# EAGLE design Shruthi-Analog-LP2Delay-v01 (EAGLE 5.09)
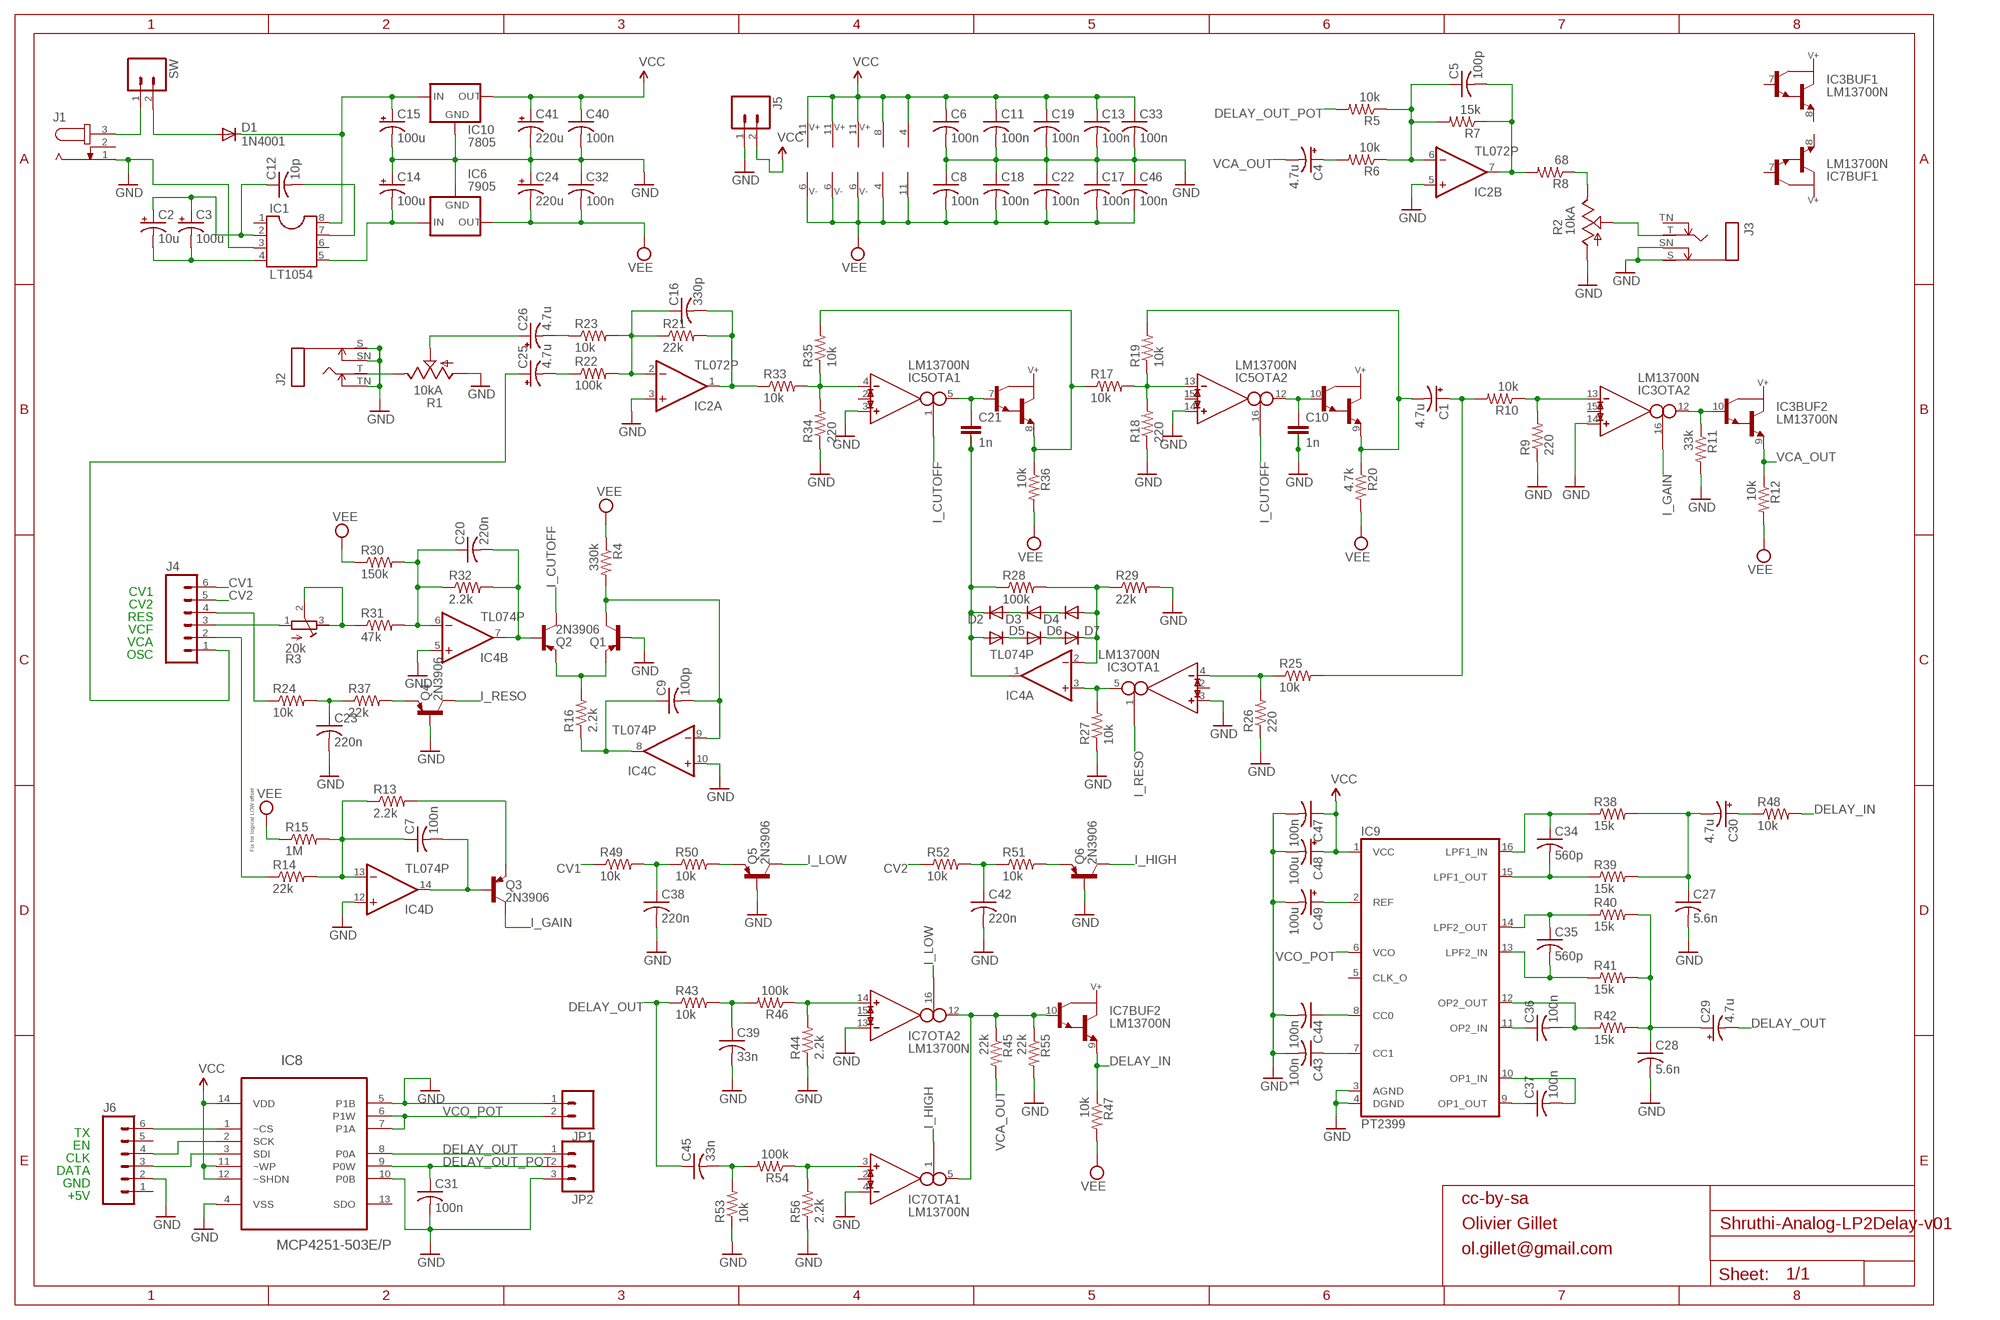
[diagram p0: schematic, sheet 1]

## Parts
C1  4.7u  CPOL-USE2.5-6  [E2,5-6]
C2  10u  CPOL-USE2.5-5  [E2,5-5]
C3  100u  CPOL-USE2.5-6  [E2,5-6]
C4  4.7u  CPOL-USE2.5-6  [E2,5-6]
C5  100p  C-US025-025X050  [C025-025X050]
C6  100n  C-US025-025X050  [C025-025X050]
C7  100n  C-US025-025X050  [C025-025X050]
C8  100n  C-US025-025X050  [C025-025X050]
C9  100p  C-US025-025X050  [C025-025X050]
C10  1n  C-2.5-5/2  [C2.5/5-2]
C11  100n  C-US025-025X050  [C025-025X050]
C12  10p  C-US025-025X050  [C025-025X050]
C13  100n  C-US025-025X050  [C025-025X050]
C14  100u  CPOL-USE2.5-7  [E2,5-7]
C15  100u  CPOL-USE2.5-7  [E2,5-7]
C16  330p  C-US025-025X050  [C025-025X050]
C17  100n  C-US025-025X050  [C025-025X050]
C18  100n  C-US025-025X050  [C025-025X050]
C19  100n  C-US025-025X050  [C025-025X050]
C20  220n  C-US025-025X050  [C025-025X050]
C21  1n  C-2.5-5/2  [C2.5/5-2]
C22  100n  C-US025-025X050  [C025-025X050]
C23  220n  C-US025-025X050  [C025-025X050]
C24  220u  CPOL-USE5-10.5  [E5-10,5]
C25  4.7u  CPOL-USE2.5-6  [E2,5-6]
C26  4.7u  CPOL-USE2.5-6  [E2,5-6]
C27  5.6n  C-US025-025X050  [C025-025X050]
C28  5.6n  C-US025-025X050  [C025-025X050]
C29  4.7u  CPOL-USE2.5-6  [E2,5-6]
C30  4.7u  CPOL-USE2.5-6  [E2,5-6]
C31  100n  C-US025-025X050  [C025-025X050]
C32  100n  C-US025-025X050  [C025-025X050]
C33  100n  C-US025-025X050  [C025-025X050]
C34  560p  C-US025-025X050  [C025-025X050]
C35  560p  C-US025-025X050  [C025-025X050]
C36  100n  C-US025-025X050  [C025-025X050]
C37  100n  C-US025-025X050  [C025-025X050]
C38  220n  C-US025-025X050  [C025-025X050]
C39  33n  C-US050-025X075  [C050-025X075]
C40  100n  C-US025-025X050  [C025-025X050]
C41  220u  CPOL-USE5-10.5  [E5-10,5]
C42  220n  C-US025-025X050  [C025-025X050]
C43  100n  C-US025-025X050  [C025-025X050]
C44  100n  C-US025-025X050  [C025-025X050]
C45  33n  C-US050-025X075  [C050-025X075]
C46  100n  C-US025-025X050  [C025-025X050]
C47  100n  C-US025-025X050  [C025-025X050]
C48  100u  CPOL-USE2.5-7  [E2,5-7]
C49  100u  CPOL-USE2.5-7  [E2,5-7]
D1  1N4001  1N4004  [DO41-10]
D2  DIODE-D-5  [D-5]
D3  DIODE-D-5  [D-5]
D4  DIODE-D-5  [D-5]
D5  DIODE-D-5  [D-5]
D6  DIODE-D-5  [D-5]
D7  DIODE-D-5  [D-5]
IC1  LT1054  DIL8  [DIL08]
IC2  TL072P  [DIL08]
IC3  LM13700N  [DIL16]
IC4  TL074P  TL084P  [DIL14]
IC5  LM13700N  [DIL16]
IC6  7905  79XXS  [79XXS]
IC7  LM13700N  [DIL16]
IC8  MCP4251-503E/P  [DIL14]
IC9  PT2399  [DIL16]
IC10  7805  78XXS  [78XXS]
J1  JACK-PLUG2  [SPC4078_BIG_HOLES]
J2  MONOSWS  [NMJ4HC-S]
J3  MONOSWS  [NMJ4HC-S]
J4  M06SIP  [1X06]
J5  M02PTH  [1X02]
J6  M06SIP  [1X06]
JP1  M02PTH  [1X02]
JP2  M03PTH  [1X03]
Q1  2N3906  2N3906-  [TO92-]
Q2  2N3906  2N3906-  [TO92-]
Q3  2N3906  2N3906-  [TO92-]
Q4  2N3906  2N3906-  [TO92-]
Q5  2N3906  2N3906-  [TO92-]
Q6  2N3906  2N3906-  [TO92-]
R1  10kA  POT_USCABLED  [CABLE_POT_6MM]
R2  10kA  POT_USCABLED  [CABLE_POT_6MM]
R3  20k  R-TRIMM3296X  [RTRIM3296X]
R4  330k  R-US_0204/7  [0204/7]
R5  10k  R-US_0204/7  [0204/7]
R6  10k  R-US_0204/7  [0204/7]
R7  15k  R-US_0204/7  [0204/7]
R8  68  R-US_0204/7  [0204/7]
R9  220  R-US_0204/7  [0204/7]
R10  10k  R-US_0204/7  [0204/7]
R11  33k  R-US_0204/7  [0204/7]
R12  10k  R-US_0204/7  [0204/7]
R13  2.2k  R-US_0204/7  [0204/7]
R14  22k  R-US_0204/7  [0204/7]
R15  1M  R-US_0204/7  [0204/7]
R16  2.2k  R-US_0204/7  [0204/7]
R17  10k  R-US_0204/7  [0204/7]
R18  220  R-US_0204/7  [0204/7]
R19  10k  R-US_0204/7  [0204/7]
R20  4.7k  R-US_0204/7  [0204/7]
R21  22k  R-US_0204/7  [0204/7]
R22  100k  R-US_0204/7  [0204/7]
R23  10k  R-US_0204/7  [0204/7]
R24  10k  R-US_0204/7  [0204/7]
R25  10k  R-US_0204/7  [0204/7]
R26  220  R-US_0204/7  [0204/7]
R27  10k  R-US_0204/7  [0204/7]
R28  100k  R-US_0204/7  [0204/7]
R29  22k  R-US_0204/7  [0204/7]
R30  150k  R-US_0204/7  [0204/7]
R31  47k  R-US_0204/7  [0204/7]
R32  2.2k  R-US_0204/7  [0204/7]
R33  10k  R-US_0204/7  [0204/7]
R34  220  R-US_0204/7  [0204/7]
R35  10k  R-US_0204/7  [0204/7]
R36  10k  R-US_0204/7  [0204/7]
R37  22k  R-US_0204/7  [0204/7]
R38  15k  R-US_0204/7  [0204/7]
R39  15k  R-US_0204/7  [0204/7]
R40  15k  R-US_0204/7  [0204/7]
R41  15k  R-US_0204/7  [0204/7]
R42  15k  R-US_0204/7  [0204/7]
R43  10k  R-US_0204/7  [0204/7]
R44  2.2k  R-US_0204/7  [0204/7]
R45  22k  R-US_0204/7  [0204/7]
R46  100k  R-US_0204/7  [0204/7]
R47  10k  R-US_0204/7  [0204/7]
R48  10k  R-US_0204/7  [0204/7]
R49  10k  R-US_0204/7  [0204/7]
R50  10k  R-US_0204/7  [0204/7]
R51  10k  R-US_0204/7  [0204/7]
R52  10k  R-US_0204/7  [0204/7]
R53  10k  R-US_0204/7  [0204/7]
R54  100k  R-US_0204/7  [0204/7]
R55  22k  R-US_0204/7  [0204/7]
R56  2.2k  R-US_0204/7  [0204/7]
SW  M02PTH  [1X02]

## Nets
2P: C1.- IC5.9(BUF2:E) R19.2 R20.1
CV1: J4.6 R49.1
CV2: J4.5 R52.1
DELAY_IN: IC7.9(BUF2:E) R47.1 R48.2
DELAY_OUT: C29.- C45.1 IC8.8(P0A) JP2.1 R43.1
DELAY_OUT_POT: C31.1 IC8.9(P0W) JP2.2 R5.2
GND: C6.2 C8.1 C10.2 C10.3 C11.2 C13.2 C14.+ C15.- C17.1 C18.1 C19.2 C22.1 C23.2 C24.+ C27.2 C28.2 C31.2 C32.1 C33.2 C38.2 C39.2 C40.2 C41.- C42.2 C43.2 C44.2 C46.1 C47.2 C48.- C49.- IC1.3 IC2.3(A:+IN) IC2.5(B:+IN) IC3.3(OTA1:IN_P) IC3.14(OTA2:IN_P) IC4.5(B:+IN) IC4.10(C:+IN) IC4.12(D:+IN) IC5.3(OTA1:IN_P) IC5.14(OTA2:IN_P) IC6.GND IC7.4(OTA1:IN_N) IC7.13(OTA2:IN_N) IC8.4(VSS) IC8.5(P1B) IC8.10(P0B) IC9.3(AGND) IC9.4(DGND) IC10.GND J1.1 J2.S J2.SN J2.TN J3.S J3.SN J5.1 J6.2 JP1.1 JP2.3 Q1.2(B) Q4.2(B) Q5.2(B) Q6.2(B) R1.A R2.A R9.1 R11.2 R18.1 R26.1 R27.1 R29.2 R34.1 R44.1 R53.1 R55.2 R56.1
I_CUTOFF: IC5.1(OTA1:I_BIAS) IC5.16(OTA2:I_BIAS) Q2.1(C)
I_GAIN: IC3.16(OTA2:I_BIAS) Q3.1(C)
I_HIGH: IC7.1(OTA1:I_BIAS) Q6.1(C)
I_LOW: IC7.16(OTA2:I_BIAS) Q5.1(C)
I_RESO: IC3.1(OTA1:I_BIAS) Q4.1(C)
MIX: C16.2 IC2.1(A:OUT) R21.2 R33.1
N$1: IC3.5(OTA1:OUT) IC4.3(A:+IN) R27.2
N$2: C20.2 IC4.7(B:OUT) Q2.2(B) R32.2
N$3: R3.2(S) R3.3(A) R31.1
N$4: J4.3 R3.1(E)
N$5: IC7.14(OTA2:IN_P) R44.2 R46.1
N$6: C16.1 IC2.2(A:-IN) R21.1 R22.2 R23.2
N$7: Q1.3(E) Q2.3(E) R16.2
N$8: D4.A D7.C IC4.2(A:-IN) R28.2 R29.1
N$9: C9.1 IC4.8(C:OUT) R16.1
N$10: C9.2 IC4.9(C:-IN) Q1.1(C) R4.2
N$11: J4.4 R24.1
N$12: Q4.3(E) R37.2
N$13: J3.T R2.S
N$14: C23.1 R24.2 R37.1
N$16: IC5.13(OTA2:IN_N) R17.2 R18.2 R19.1
N$17: IC8.1(~CS) J6.6
N$18: C1.+ R10.2 R25.2
N$19: IC5.8(BUF1:E) R17.1 R35.2 R36.1
N$20: C10.1 IC5.10(BUF2:B) IC5.12(OTA2:OUT)
N$21: IC8.2(SCK) J6.4
N$22: IC8.3(SDI) J6.3
N$23: IC5.4(OTA1:IN_N) R33.2 R34.2 R35.1
N$24: D3.A D4.C
N$25: R2.E R8.1
N$26: D2.A D3.C
N$27: C21.1 IC5.5(OTA1:OUT) IC5.7(BUF1:B)
N$28: D5.C D6.A
N$29: IC3.4(OTA1:IN_N) R25.1 R26.2
N$30: D6.C D7.A
N$31: C7.2 IC4.14(D:OUT) Q3.2(B)
N$32: C37.1 IC9.9(OP1_OUT)
N$33: IC3.10(BUF2:B) IC3.12(OTA2:OUT) R11.1
N$34: IC3.13(OTA2:IN_N) R9.2 R10.1
N$35: C25.+ J4.1
N$36: C43.1 IC9.7(CC1)
N$37: C44.1 IC9.8(CC0)
N$38: J2.T R1.E
N$39: C25.- R22.1
N$40: C20.1 IC4.6(B:-IN) R30.2 R31.2 R32.1
N$41: C30.+ R48.1
N$42: C49.+ IC9.2(REF)
N$43: C37.2 IC9.10(OP1_IN)
N$44: J1.3 SW.1
N$45: J4.2 R14.1
N$46: C15.+ D1.C IC1.8 IC10.IN
N$47: C2.+ C3.+ C12.1 IC1.2
N$48: C2.- C3.- IC1.4
N$49: C12.2 IC1.7
N$50: C36.1 IC9.11(OP2_IN)
N$51: C7.1 IC4.13(D:-IN) R13.1 R14.2 R15.2
N$55: C36.2 IC9.12(OP2_OUT) R42.1
N$56: C35.1 IC9.14(LPF2_OUT) R40.1
N$57: C34.2 IC9.15(LPF1_OUT) R39.1
N$58: C14.- IC1.5 IC6.IN
N$59: D1.A SW.2
N$60: C28.1 C29.+ R40.2 R41.2 R42.2
N$61: C35.2 IC9.13(LPF2_IN) R41.1
N$62: C34.1 IC9.16(LPF1_IN) R38.1
N$63: C5.2 IC2.7(B:OUT) R7.1 R8.2
N$64: C27.1 C30.- R38.2 R39.2
N$65: C21.2 C21.3 D2.C D5.A IC4.1(A:OUT) R28.1
N$66: C26.+ R1.S
N$67: C4.+ R6.2
N$68: Q3.3(E) R13.2
N$70: C5.1 IC2.6(B:-IN) R5.1 R6.1 R7.2
N$71: C39.1 R43.2 R46.2
N$72: C26.- R23.1
N$74: C38.1 R49.2 R50.1
N$75: IC7.3(OTA1:IN_P) R54.1 R56.2
N$76: C45.2 R53.2 R54.2
N$77: IC7.5(OTA1:OUT) IC7.10(BUF2:B) IC7.12(OTA2:OUT) R45.1 R55.1
N$78: Q5.3(E) R50.2
N$80: C42.1 R51.1 R52.2
N$81: Q6.3(E) R51.2
VCA_OUT: C4.- IC3.9(BUF2:E) R12.1 R45.2
VCC: C6.1 C11.1 C13.1 C19.1 C33.1 C40.1 C41.+ C47.1 C48.+ IC2.8(P:V+) IC3.11(SUPPLY:V+) IC4.4(P:V+) IC5.11(SUPPLY:V+) IC7.11(SUPPLY:V+) IC8.11(~WP) IC8.12(~SHDN) IC8.14(VDD) IC9.1(VCC) IC10.OUT J5.2
VCO_POT: IC8.6(P1W) IC8.7(P1A) IC9.6(VCO) JP1.2
VEE: C8.2 C17.2 C18.2 C22.2 C24.- C32.2 C46.2 IC2.4(P:V-) IC3.6(SUPPLY:V-) IC4.11(P:V-) IC5.6(SUPPLY:V-) IC6.OUT IC7.6(SUPPLY:V-) R4.1 R12.2 R15.1 R20.2 R30.1 R36.2 R47.2
Unconnected: IC1.1 IC1.6 IC3.2(OTA1:I_DIODE) IC3.7(BUF1:B) IC3.8(BUF1:E) IC3.15(OTA2:I_DIODE) IC5.2(OTA1:I_DIODE) IC5.15(OTA2:I_DIODE) IC7.2(OTA1:I_DIODE) IC7.7(BUF1:B) IC7.8(BUF1:E) IC7.15(OTA2:I_DIODE) IC8.13(SDO) IC9.5(CLK_O) J1.2 J3.TN J6.1 J6.5

## Notes on the sheet
- CV1
- CV2
- RES
- VCF
- VCA
- OSC
- Fix for logical LOW offset
- TX
- EN
- CLK
- DATA
- GND
- +5V
- cc-by-sa
- Olivier Gillet
- ol.gillet@gmail.com

## Library data of the parts
C1-C4 C14 C15 C24-C26 C29 C30 C41 C48 C49 = rcl:CPOL-US: POLARIZED CAPACITOR, American symbol
C5-C9 C11-C13 C16-C20 C22 C23 C27 C28 C31-C40 C42-C47 = rcl:C-US: CAPACITOR, American symbol
C10 C21 = capacitor-wima:C-: CAPACITOR for alternative placement naming: default grid - extended grid/package width
D1 = diode:1N4004: DIODE general purpose rectifier, 1 A
D2-D7 = diode:DIODE-: DIODE
IC1 = ic-package:DIL8: Dual In Line / Socket
IC2 = og-linear:TL072: OP AMP
IC3 IC5 IC7 = ota:LM13700: Dual OTA with buffers
IC4 = linear:TL084: OP AMP
IC6 = v-reg:79XXS: VOLTAGE REGULATOR
IC8 = og-dac:MCP4251-503E/P: Digital POT
IC9 = og-ics:PT2399
IC10 = v-reg:78XXS: VOLTAGE REGULATOR
J1 = con-jack2:JACK-PLUG: DC POWER JACK Power Jack, DC, Right Angle, Through Hole, Rated 5A at 16VDC, PC Terminals Distributor: Farnell (www.Farnell.de) Drawing: 84N1161.pdf / 84N1162.pdf Manufacturer: SPC Technology (www.spctechnology.com) Type: SPC4077 / SPC 4078
J2 J3 = og-neutrik:MONOSW
J4 J6 = SparkFun:M06: Header 6 Standard 6-pin 0.1" header. Use with straight break away headers (SKU : PRT-00116), right angle break away headers (PRT-00553), swiss pins (PRT-00743), machine pins (PRT-00117), and female headers (PRT-00115). Molex polarized connector foot print use with SKU : PRT-08094 with associated crimp pins and housings. NOTES ON THE VARIANTS LOCK and LOCK_LONGPADS... This footprint was designed to help hold the alignment of a through-hole component (i.e. 6-pin header) while soldering it into place. You may notice that each hole has been shifted either up or down by 0.005 of an inch from it's more standard position (which is a perfectly straight line). This slight alteration caused the pins (the squares in the middle) to touch the edges of the holes. Because they are alternating, it causes a "brace" to hold the component in place. 0.005 has proven to be the perfect amount of "off-center" position when using our standard breakaway headers. Although looks a little odd when you look at the bare footprint, once you have a header in there, the alteration is very hard to notice. Also, if you push a header all the way into place, it is covered up entirely on the bottom side. This idea of altering the position of holes to aid alignment will be further integrated into the Sparkfun Library for other footprints. It can help hold any component with 3 or more connection pins.
J5 JP1 SW = SparkFun:M02: Header 2 Standard 2-pin 0.1" header. Use with straight break away headers (SKU : PRT-00116), right angle break away headers (PRT-00553), swiss pins (PRT-00743), machine pins (PRT-00117), and female headers (PRT-00115). Molex polarized connector foot print use with SKU : PRT-08233 with associated crimp pins and housings.
JP2 = SparkFun:M03: Header 3 Standard 3-pin 0.1" header. Use with straight break away headers (SKU : PRT-00116), right angle break away headers (PRT-00553), swiss pins (PRT-00743), machine pins (PRT-00117), and female headers (PRT-00115). Molex polarized connector foot print use with SKU : PRT-08232 with associated crimp pins and housings.
Q1-Q6 = gm-trans:2N3906: PNP Transistor
R1 R2 = pot-alps:POT_US
R3 = rcl:R-TRIMM: Trimm resistor
R4-R56 = rcl:R-US_: RESISTOR, American symbol

## Board
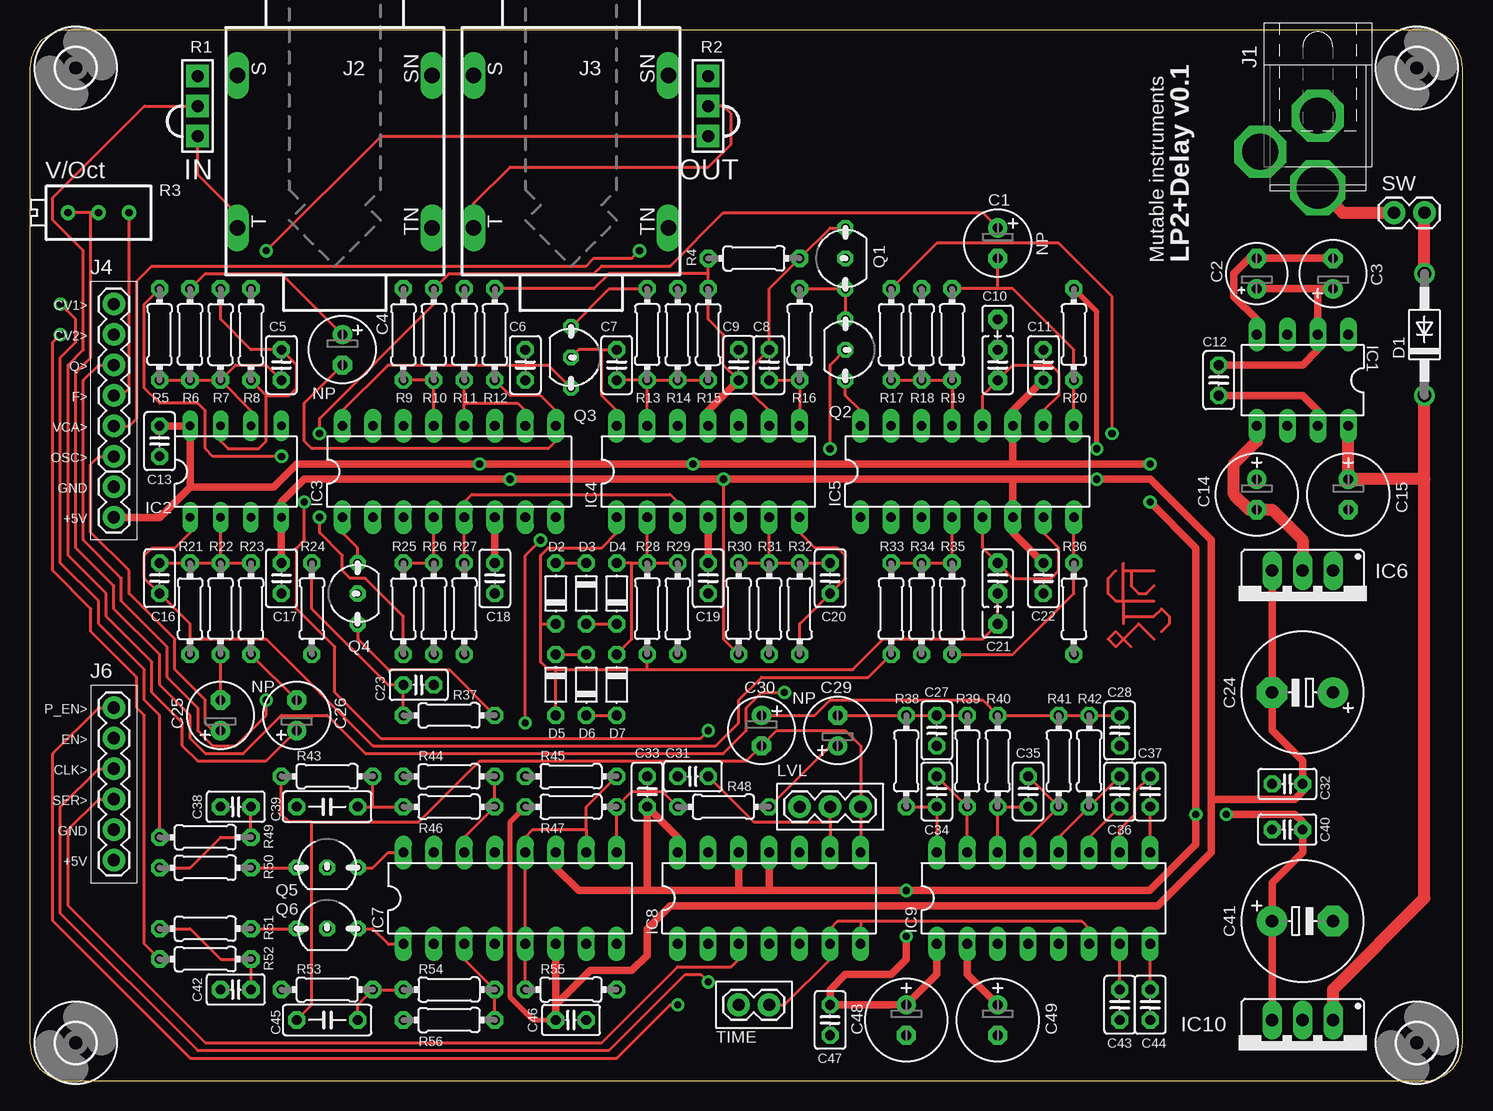
[diagram p1: board, top side]
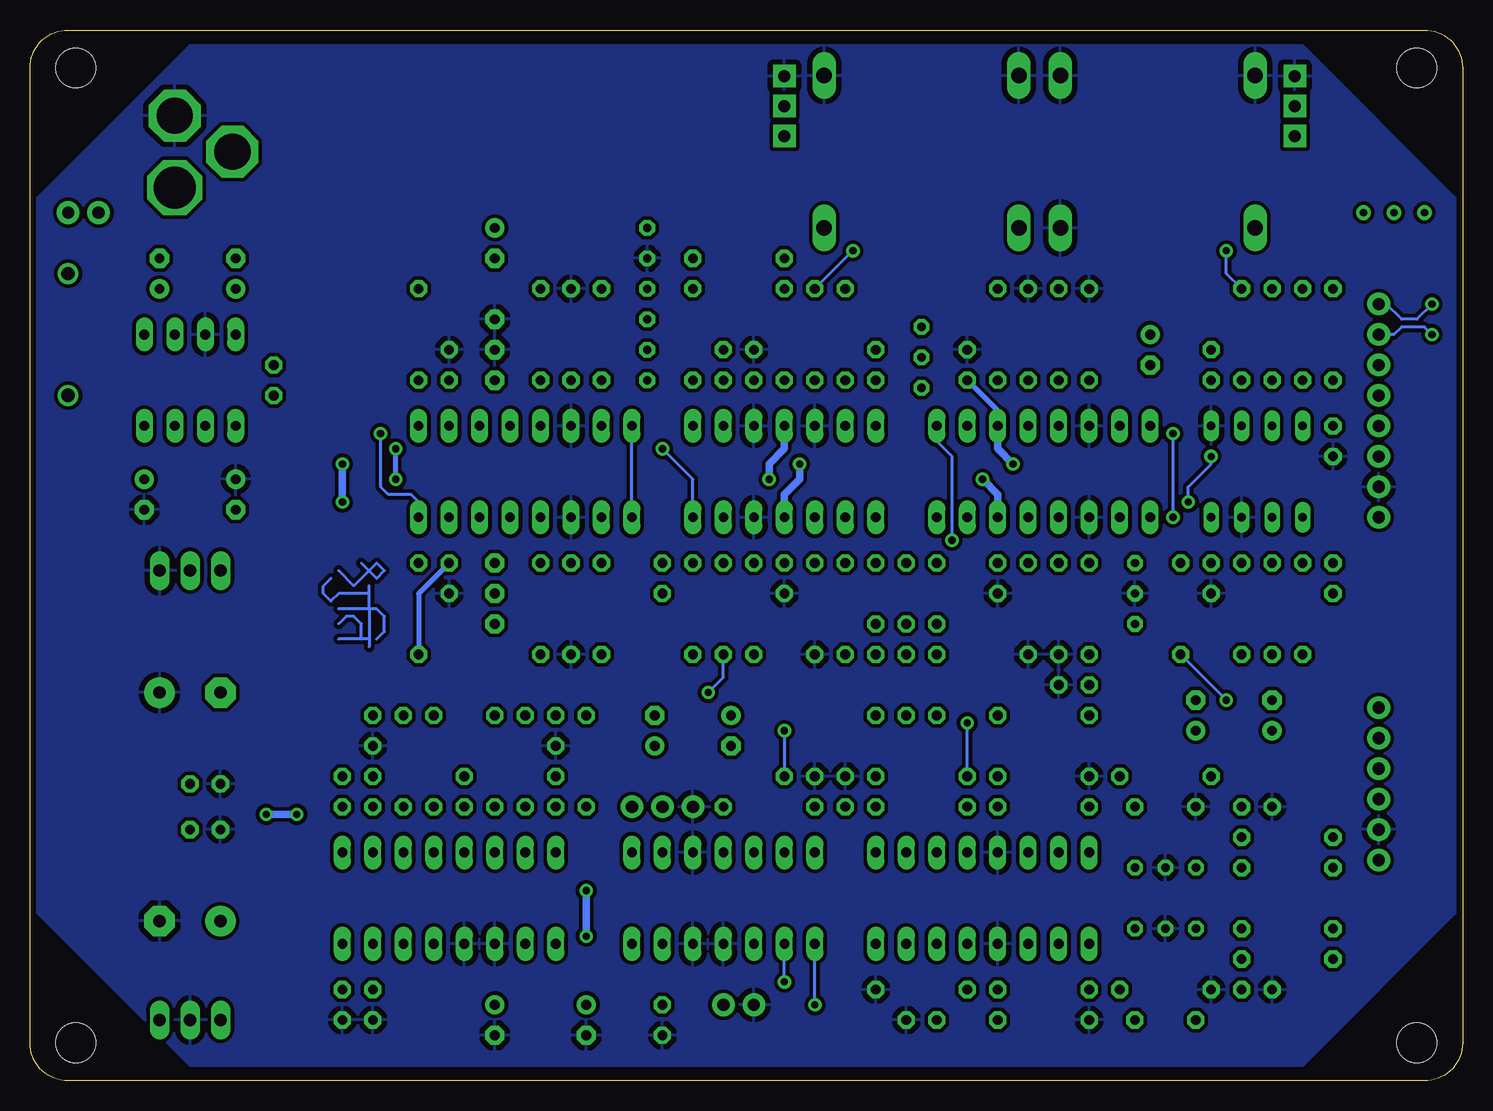
[diagram p2: board, bottom side, seen from below]

Size 119.38 x 87.62 mm. Coordinates in mm from the lower left corner, seen from the top.
Outline: 119.38,84.45 arc90 116.2,87.62 3.18,87.62 arc90 0,84.45 0,3.17 arc90 3.18,0 116.2,0 arc90 119.38,3.17 119.38,84.45
Copper layers (1*16): Top 0.035mm / dielectric 1.5mm / Bottom 0.035mm
Design rules "SparkFun_10mil *": minimum track width 8mil, minimum drill 20mil, track to track 8mil, track to pad 8mil, pad to pad 8mil, via to via 8mil, smd to smd 8mil, copper to edge 8mil, drill to drill 8mil, minimum pad ring 12mil, minimum via ring 10mil, stop-mask expansion 4mil, vias tented up to drill 25mil, thermal gap 18mil

### Footprints (pad centres in the part's own frame; a part is rotated, then mirrored left to right if it is on the bottom)
E2,5-6 = drill 0.813 pad 1.6 round: + -1.27,0 | drill 0.813 pad 1.6 octagon: - 1.27,0
E2,5-5 = drill 0.813 pad 1.6 round: + -1.27,0 | drill 0.813 pad 1.6 octagon: - 1.27,0
C025-025X050 = drill 0.813 octagon: 1 -1.27,0; 2 1.27,0
C2.5/5-2 = drill 0.813 pad 1.6 octagon: 1 -1.27,0; 2 1.27,0; 3 3.81,0
E2,5-7 = drill 0.813 pad 1.6 round: + -1.27,0 | drill 0.813 pad 1.6 octagon: - 1.27,0
E5-10,5 = drill 1.016 pad 2.54 round: + -2.54,0 | drill 1.016 pad 2.54 octagon: - 2.54,0
C050-025X075 = drill 0.813 octagon: 1 -2.54,0; 2 2.54,0
DO41-10 = drill 1.118 round: A 5.08,0; C -5.08,0
D-5 = drill 0.813 octagon: A 2.54,0; C -2.54,0
DIL08 = drill 0.813 long: 1 -3.81,-3.81; 2 -1.27,-3.81; 3 1.27,-3.81; 4 3.81,-3.81; 5 3.81,3.81; 6 1.27,3.81; 7 -1.27,3.81; 8 -3.81,3.81
DIL08' = drill 0.7 long: 1 -3.81,-3.81; 2 -1.27,-3.81; 3 1.27,-3.81; 4 3.81,-3.81; 5 3.81,3.81; 6 1.27,3.81; 7 -1.27,3.81; 8 -3.81,3.81
DIL16 = drill 0.813 long: 1 -8.89,-3.81; 2 -6.35,-3.81; 3 -3.81,-3.81; 4 -1.27,-3.81; 5 1.27,-3.81; 6 3.81,-3.81; 7 6.35,-3.81; 8 8.89,-3.81; 9 8.89,3.81; 10 6.35,3.81; 11 3.81,3.81; 12 1.27,3.81; 13 -1.27,3.81; 14 -3.81,3.81; 15 -6.35,3.81; 16 -8.89,3.81
DIL14 = drill 0.813 long: 1 -7.62,-3.81; 2 -5.08,-3.81; 3 -2.54,-3.81; 4 0,-3.81; 5 2.54,-3.81; 6 5.08,-3.81; 7 7.62,-3.81; 8 7.62,3.81; 9 5.08,3.81; 10 2.54,3.81; 11 0,3.81; 12 -2.54,3.81; 13 -5.08,3.81; 14 -7.62,3.81
79XXS = drill 1.016 long: GND -2.54,-2.54; IN 0,-2.54; OUT 2.54,-2.54
78XXS = drill 1.016 long: GND 0,-2.54; IN -2.54,-2.54; OUT 2.54,-2.54
SPC4078_BIG_HOLES = drill 3.023 pad 4.318 octagon: 1 -0.46,0; 2 2.54,-4.8 | drill 3.531 pad 4.572 octagon: 3 5.54,0
NMJ4HC-S = drill 1.3 long: S 5.08,8.115; SN 5.08,-8.115; T -7.62,8.115; TN -7.62,-8.115
1X06 = drill 1.016 pad 1.88 round: 1 0,0; 2 2.54,0; 3 5.08,0; 4 7.62,0; 5 10.16,0; 6 12.7,0
1X02 = drill 1.016 pad 1.88 round: 1 0,0; 2 2.54,0
1X03 = drill 1.016 pad 1.88 round: 1 0,0; 2 2.54,0; 3 5.08,0
TO92- = drill 0.7 octagon: 1 2.54,0; 2 0,0; 3 -2.54,0
CABLE_POT_6MM = drill 1 pad 1.88 square: A -2.5,0; E 2.5,0; S 0,0
RTRIM3296X = drill 0.61 round: 1 0,-2.54; 2 0,0; 3 0,2.54
0204/7 = drill 0.813 octagon: 1 -3.81,0; 2 3.81,0
3,3 = hole 3.3: 0,0

### Placement (x,y rotation side)
C1  80.64,69.85 270 top
C2  102.23,67.31 90 top
C3  108.58,67.31 90 top
C4  26.04,60.96 270 top
C5  20.96,59.69 90 top
C6  41.27,59.69 90 top
C7  48.89,59.69 90 top
C8  59.05,59.69 270 top
C9  61.59,59.69 90 top
C10  80.64,59.69 90 top
C11  84.45,59.69 90 top
C12  99.06,58.42 270 top
C13  10.79,53.34 270 top
C14  102.23,48.9 270 top
C15  109.86,48.9 270 top
C16  10.79,41.91 270 top
C17  20.96,41.91 90 top
C18  38.73,41.91 90 top
C19  56.52,41.91 270 top
C20  66.67,41.91 270 top
C21  80.64,41.91 270 top
C22  84.45,41.91 90 top
C23  32.38,33.02 0 top
C24  106.05,32.38 180 top
C25  15.88,30.48 90 top
C26  22.23,30.48 90 top
C27  75.56,29.21 270 top
C28  90.8,29.21 270 top
C29  60.96,29.21 270 top
C30  67.31,29.21 90 top
C31  55.24,25.4 180 top
C32  104.78,24.76 0 top
C33  51.44,24.13 90 top
C34  75.56,24.13 90 top
C35  83.19,24.13 90 top
C36  90.8,24.13 90 top
C37  93.34,24.13 90 top
C38  17.14,22.86 180 top
C39  24.77,22.86 180 top
C40  104.78,20.95 180 top
C41  106.05,13.34 0 top
C42  17.14,7.62 180 top
C43  90.8,6.35 270 top
C44  93.34,6.35 270 top
C45  24.77,5.08 0 top
C46  45.09,5.08 180 top
C47  66.67,5.08 270 top
C48  73.03,5.08 270 top
C49  80.64,5.08 270 top
D1  116.2,62.23 90 top
D2  43.81,40.64 90 top
D3  46.35,40.64 270 top
D4  48.89,40.64 90 top
D5  43.81,33.02 270 top
D6  46.35,33.02 90 top
D7  48.89,33.02 270 top
IC1  106.05,58.42 180 top
IC2  TL072P  [DIL08']  17.14,50.8 0 top
IC3  34.93,50.8 0 top
IC4  56.52,50.8 0 top
IC5  78.11,50.8 0 top
IC6  106.05,40.01 180 top
IC7  40.01,15.24 0 top
IC8  61.59,15.24 0 top
IC9  84.45,15.24 0 top
IC10  106.05,2.54 180 top
J1  107.31,80.01 270 top
J2  25.4,78.74 90 top
J3  45.09,78.74 90 top
J4  6.99,52.07 90 top
J5  6.99,49.53 270 top
J6  6.99,18.41 90 top
JP1  59.05,6.35 0 top
JP2  69.22,22.86 180 top
Q1  67.95,68.58 90 top
Q2  67.95,60.96 270 top
Q3  45.09,60.33 270 top
Q4  27.3,40.64 90 top
Q5  24.77,17.78 0 top
Q6  24.77,12.7 0 top
R1  13.97,81.28 270 top
R2  56.52,81.28 270 top
R3  5.71,72.39 90 top
R4  60.33,68.58 0 top
R5  10.79,62.23 90 top
R6  13.34,62.23 90 top
R7  15.88,62.23 270 top
R8  18.41,62.23 270 top
R9  31.11,62.23 270 top
R10  33.66,62.23 90 top
R11  36.2,62.23 90 top
R12  38.73,62.23 90 top
R13  51.44,62.23 90 top
R14  53.98,62.23 270 top
R15  56.52,62.23 270 top
R16  64.14,62.23 90 top
R17  71.75,62.23 270 top
R18  74.3,62.23 270 top
R19  76.83,62.23 90 top
R20  87,62.23 90 top
R21  13.34,39.37 270 top
R22  15.88,39.37 90 top
R23  18.41,39.37 90 top
R24  23.5,39.37 90 top
R25  31.11,39.37 270 top
R26  33.66,39.37 90 top
R27  36.2,39.37 90 top
R28  51.44,39.37 90 top
R29  53.98,39.37 270 top
R30  59.05,39.37 90 top
R31  61.59,39.37 90 top
R32  64.14,39.37 270 top
R33  71.75,39.37 90 top
R34  74.3,39.37 90 top
R35  76.83,39.37 270 top
R36  87,39.37 270 top
R37  34.93,30.48 0 top
R38  73.03,26.67 90 top
R39  78.11,26.67 90 top
R40  80.64,26.67 90 top
R41  85.72,26.67 90 top
R42  88.27,26.67 90 top
R43  24.77,25.4 0 top
R44  34.93,25.4 0 top
R45  45.09,25.4 180 top
R46  34.93,22.86 180 top
R47  45.09,22.86 180 top
R48  57.78,22.86 180 top
R49  14.61,20.32 0 top
R50  14.61,17.78 0 top
R51  14.61,12.7 0 top
R52  14.61,10.16 0 top
R53  24.77,7.62 0 top
R54  34.93,7.62 180 top
R55  45.09,7.62 0 top
R56  34.93,5.08 0 top
SW  113.67,72.39 0 top
U$1  [3,3]  3.81,84.45 0 top
U$2  [3,3]  115.57,84.45 0 top
U$3  [3,3]  3.81,3.17 0 top
U$4  [3,3]  115.57,3.17 0 top
U$5  [SLUMP_BOY_RACCOON]  93.03,88.27 270 bottom

### Tracks (layer width: path | path; a pad name or v marks a point on that pad's centre or on a via)
2P
  Top 0.254: IC5.9 R20.1 87,60.96 81.92,66.04 80.64,66.04 | 80.64,66.04 R19.2 | 80.64,66.04 C1.-
CV1  (via drill 0.6)
  Top 0.254: v2.54,64.77 3.81,63.5 3.81,61.59 2.54,60.33 2.54,43.18 5.71,40.01 5.71,38.1 9.53,34.29 9.53,31.75 10.79,30.48 R49.1
  Bottom 0.254: v2.54,64.77 3.81,63.5 5.08,63.5 6.35,64.77 J4.6
CV2  (via drill 0.6)
  Top 0.254: v2.54,62.23 1.91,61.59 1.91,42.55 5.08,39.37 5.08,37.47 8.89,33.66 8.89,31.11 9.53,30.48 9.53,11.43 R52.1
  Bottom 0.254: v2.54,62.23 3.18,62.87 5.08,62.87 5.71,62.23 J4.5
DELAY_IN
  Top 0.254: IC7.9 R47.1 50.16,24.13 52.7,24.13 R48.2
DELAY_OUT
  Top 0.254: 23.5,21.59 21.59,21.59 20.96,22.22 R43.1 | 23.5,21.59 32.38,21.59 37.47,26.67 59.69,26.67 C29.- 62.23,29.21 67.95,29.21 69.22,27.94 JP2.1 IC8.8 | C45.1 23.5,6.35 23.5,21.59
DELAY_OUT_POT  (via drill 0.6)
  Top 0.254: 66.67,21.59 IC8.9 | 66.67,21.59 60.33,21.59 C31.1 | v22.86,48.26 22.86,45.09 22.23,44.45 22.23,39.37 25.4,36.2 25.4,32.38 29.21,28.57 55.88,28.57 v56.52,29.21 | v20.96,52.07 15.24,52.07 14.61,52.71 14.61,55.88 13.97,56.52 10.79,56.52 9.53,57.79 9.53,64.77 R5.2 | 66.67,21.59 JP2.2
  Bottom 0.254: v22.86,48.26 22.86,49.53 20.96,51.44 v20.96,52.07 | v56.52,29.21 C31.1
GND
  pour Bottom (isolate 0.305): 118.75,73.66 106.05,86.36 13.34,86.36 0.64,73.66 0.64,13.97 13.34,1.27 106.05,1.27 118.75,13.97
I_CUTOFF
  Top 0.254: IC5.16 69.22,55.88 67.95,57.15 Q2.1
  Bottom 0.254: IC5.1 IC5.16
I_GAIN
  Top 0.254: Q3.1 43.18,59.69 29.84,59.69 26.04,55.88 IC3.16
I_HIGH
  Top 0.254: Q6.1 28.57,12.7 29.84,11.43 IC7.1
I_LOW
  Top 0.254: Q5.1 28.57,17.78 29.84,19.05 IC7.16
I_RESO
  Top 0.254: IC3.1 26.04,45.72 27.3,44.45 Q4.1
MIX
  Top 0.254: IC2.1 13.34,45.72 12.07,44.45 10.16,44.45 9.53,43.82 9.53,41.91 C16.2 13.34,38.1 13.34,36.83 | R21.2 13.34,36.83 | R33.1 69.85,33.66 60.96,33.66 59.05,31.75 59.05,29.84 57.15,27.94 28.57,27.94 19.68,36.83 13.34,36.83
N$1
  Top 0.254: R27.2 IC3.5 36.2,48.26 36.83,48.9 53.34,48.9 53.98,48.26 IC4.3
N$2  (via drill 0.6)
  Top 0.254: Q2.2 66.67,59.69 v66.67,52.71 | IC4.7 64.14,45.72 65.41,44.45 67.31,44.45 67.95,43.82 67.95,41.91 C20.2 64.14,38.1 R32.2
  Bottom 0.254: v66.67,52.71 64.14,50.16 IC4.7
N$3  (via drill 0.6)
  Top 0.254: 5.08,72.39 R3.3 | 5.08,72.39 R3.2 | 5.08,72.39 5.08,60.33 3.81,59.05 3.81,44.45 6.99,41.28 6.99,39.37 10.79,35.56 10.79,33.02 13.34,30.48 13.34,28.57 14.61,27.3 17.78,27.3 20.96,30.48 24.77,30.48 27.94,27.3 57.78,27.3 59.69,29.21 59.69,31.11 60.96,32.38 v62.87,32.38
  Bottom 0.254: v62.87,32.38 61.59,33.66 R31.1
N$4
  Top 0.254: J4.3 7.62,57.15 8.26,57.79 R3.1
N$5
  Top 0.254: R44.2 R46.1 36.2,20.32 IC7.14
N$6
  Top 0.254: R22.2 IC2.2 | C16.1 R21.1 R22.2 | R22.2 R23.2
N$7
  Top 0.254: R16.2 Q1.3 Q2.3
N$8
  Top 0.254: R28.2 IC4.2 | R28.2 R29.1 | 50.16,43.18 D4.A | 50.16,43.18 R28.2 | D7.C 50.16,36.83 50.16,43.18
N$9
  Top 0.254: IC4.8 R16.1 C9.1
N$10
  Top 0.254: Q1.1 66.67,71.12 R4.2 61.59,66.04 C9.2 60.33,59.69 60.33,57.15 61.59,55.88 IC4.9
N$11  (via drill 0.6)
  Top 0.254: J4.4 5.71,59.69 4.45,58.42 4.45,45.09 7.62,41.91 7.62,40.01 11.43,36.2 11.43,33.66 13.97,31.11 13.97,29.21 15.24,27.94 17.14,27.94 19.68,30.48 v19.68,31.75
  Bottom 0.254: v19.68,31.75 R24.1
N$12
  Top 0.254: Q4.3 27.3,36.83 29.84,34.29 34.93,34.29 R37.2
N$13
  Top 0.254: R2.S 57.78,81.28 58.42,80.64 58.42,78.11 56.52,76.2 40.01,76.2 36.97,73.17 J3.T
N$14
  Top 0.254: R24.2 23.5,39.37 29.84,33.02 C23.1 R37.1
N$15
  Bottom 0.254: 93.66,42.55 92.39,41.28 90.49,43.18 89.85,42.55 90.49,41.91 91.76,43.18
N$16
  Top 0.254: R17.2 R18.2 R19.1 IC5.13
N$17  (via drill 0.6)
  Top 0.254: J6.6 5.71,31.11 1.91,27.3 1.91,13.34 13.34,1.91 48.89,1.91 53.34,6.35 v53.98,6.35
  Bottom 0.254: v53.98,6.35 IC8.1
N$18  (via drill 0.6)
  Top 0.254: v24.13,46.99 24.13,45.72 26.04,43.82 26.04,42.55 26.67,41.91 27.94,41.91 31.11,38.73 R25.2 | v24.13,53.98 24.13,55.25 33.66,64.77 R10.2 34.93,67.31 46.99,67.31 47.62,67.95 53.34,67.95 57.78,72.39 79.38,72.39 C1.+
  Bottom 0.254: v24.13,46.99 v24.13,53.98
N$19  (via drill 0.6)
  Top 0.254: IC5.8 R36.1 87,40.64 81.92,35.56 R35.2 | R17.1 75.56,69.85 85.72,69.85 90.17,65.41 v90.17,53.98
  Bottom 0.254: v90.17,53.98 90.17,49.53 89.53,48.9 87.63,48.9 87,48.26 IC5.8
N$20
  Top 0.254: IC5.12 79.38,57.15 C10.1 81.92,59.69 85.09,59.69 85.72,59.05 85.72,57.15 84.45,55.88 IC5.10
N$21  (via drill 0.6)
  Top 0.254: J6.4 5.71,26.04 2.54,22.86 2.54,13.97 13.97,2.54 48.26,2.54 54.61,8.89 55.88,8.89 v56.52,8.26
  Bottom 0.254: v56.52,8.26 IC8.2
N$22
  Top 0.254: J6.3 5.71,23.49 3.18,20.95 3.18,14.61 14.61,3.17 47.62,3.17 53.98,9.53 58.42,9.53 59.05,10.16 IC8.3
N$23
  Top 0.254: R33.2 R34.2 R35.1 IC5.4
N$24
  Top 0.254: D3.A D4.C
N$25  (via drill 0.6)
  Top 0.254: v19.68,69.22 29.25,78.78 R2.E
  Bottom 0.254: R8.1 19.68,67.31 v19.68,69.22
N$26
  Top 0.254: D2.A D3.C
N$27
  Top 0.254: IC5.5 79.38,44.45 C21.1 81.92,41.91 85.09,41.91 85.72,42.55 85.72,44.45 84.45,45.72 IC5.7
N$28
  Top 0.254: D5.C D6.A
N$29
  Top 0.254: IC3.4 R26.2 R25.1
N$30
  Top 0.254: D6.C D7.A
N$31
  Top 0.254: Q3.2 45.72,60.96 47.62,60.96 | 47.62,60.96 C7.2 | IC4.14 48.89,55.88 47.62,57.15 47.62,60.96
N$32
  Top 0.254: IC9.9 C37.1
N$33
  Top 0.254: IC3.12 36.2,56.52 | 36.2,56.52 R11.1 | IC3.10 41.27,55.88 40.64,56.52 36.2,56.52
N$34
  Top 0.254: IC3.13 R10.1 R9.2
N$35
  Top 0.254: C25.+ 15.24,29.21 14.61,29.84 14.61,31.75 12.07,34.29 12.07,36.83 8.26,40.64 8.26,42.55 5.08,45.72 5.08,51.44 5.71,52.07 J4.1
N$36
  Top 0.254: C43.1 IC9.7
N$37
  Top 0.254: C44.1 IC9.8
N$38
  Top 0.254: J2.T 17.14,71.26 17.14,72.39 13.97,75.56 R1.E
N$39
  Top 0.254: C25.- R22.1
N$40
  Top 0.254: C20.1 R32.1 R31.2 | R30.2 R31.2 | R31.2 IC4.6
N$41
  Top 0.254: R48.1 66.67,27.94 C30.+
N$42
  Top 0.61: C49.+ 78.11,8.89 IC9.2
N$43
  Top 0.254: C37.2 92.08,24.13 92.08,22.22 90.8,20.95 IC9.10
N$44
  Top 1.016: J1.3 109.39,72.39 SW.1
N$45  (via drill 0.6)
  Top 0.254: J4.2 8.26,54.61 8.89,55.25 8.89,66.67 10.16,67.95 46.35,67.95 46.99,68.58 50.16,68.58 v50.8,69.22
  Bottom 0.254: v50.8,69.22 R14.1
N$46
  Top 1.016: 116.2,50.16 D1.C | 116.2,50.16 C15.+ IC1.8 | IC10.IN 108.58,7.62 116.2,15.24 116.2,50.16
N$47
  Top 0.61: C12.1 106.05,59.69 107.31,60.96 IC1.2 107.31,66.04 | 107.31,66.04 C3.+ | 107.31,66.04 C2.+
N$48
  Top 0.61: IC1.4 102.23,63.5 100.33,65.41 100.33,67.31 101.6,68.58 C2.- C3.-
N$49
  Top 0.61: IC1.7 107.31,55.88 106.05,57.15 C12.2
N$50
  Top 0.254: IC9.11 88.27,20.32 C36.1
N$51
  Top 0.254: IC4.13 R13.1 | R13.1 C7.1 | R13.1 R14.2 R15.2
N$52
  Bottom 0.254: 91.12,40.64 91.12,41.28 | 91.12,39.37 91.12,40.64 | 91.12,39.37 91.12,36.83 | 91.12,36.83 91.12,36.2 | 91.76,36.83 93.66,36.83 | 91.12,36.83 91.76,36.83 | 91.76,36.83 91.76,38.1 92.39,38.73 93.03,38.73 93.66,38.1 | 91.12,40.64 93.66,40.64 94.3,40.01 94.93,40.64 94.93,41.28 94.3,41.91 | 91.12,39.37 93.66,39.37 | 91.12,39.37 90.49,39.37 89.85,38.73 89.85,37.47 90.49,36.83
N$53
  Top 0.254: 93.66,36.83 92.39,38.1 90.49,36.2 89.85,36.83 90.49,37.47 91.76,36.2
N$54
  Top 0.254: 91.12,38.73 91.12,38.1 | 91.12,40.01 91.12,38.73 | 91.12,40.01 91.12,42.55 | 91.12,42.55 91.12,43.18 | 91.76,42.55 93.66,42.55 | 91.12,42.55 91.76,42.55 | 91.76,42.55 91.76,41.28 92.39,40.64 93.03,40.64 93.66,41.28 | 91.12,38.73 93.66,38.73 94.3,39.37 94.93,38.73 94.93,38.1 94.3,37.47 | 91.12,40.01 93.66,40.01 | 91.12,40.01 90.49,40.01 89.85,40.64 89.85,41.91 90.49,42.55
N$55
  Top 0.254: C36.2 R42.1 85.72,20.32 IC9.12
N$56
  Top 0.254: C35.1 R40.1 IC9.14
N$57
  Top 0.254: IC9.15 R39.1 C34.2
N$58
  Top 1.016: IC1.5 102.23,53.34 100.33,51.44 100.33,48.9 101.6,47.62 C14.- 103.5,47.62 106.05,45.09 IC6.IN
N$59
  Top 1.016: D1.A SW.2
N$60
  Top 0.254: C28.1 R42.2 R41.2 R40.2 79.38,31.75 66.67,31.75 65.41,30.48 64.14,30.48 C29.+
N$61
  Top 0.254: IC9.13 83.19,20.32 R41.1 C35.2
N$62
  Top 0.254: IC9.16 C34.1 R38.1
N$63
  Top 0.254: IC2.7 15.88,53.34 16.51,52.71 19.05,52.71 19.68,53.34 19.68,57.15 | 19.68,57.15 R8.2 | R7.1 15.88,63.5 18.41,60.96 C5.2 22.23,59.69 22.23,57.79 21.59,57.15 19.68,57.15
N$64
  Top 0.254: R39.2 C27.1 R38.2 C30.-
N$65
  Top 0.254: IC4.1 48.89,45.72 47.62,44.45 43.18,44.45 42.55,43.82 42.55,38.1 | 42.55,38.1 D2.C | 43.81,34.29 43.18,34.29 42.55,34.92 42.55,38.1 | D5.A 43.81,34.29 | C21.2 C21.3 79.38,36.83 71.12,36.83 68.58,34.29 51.44,34.29 | 43.81,34.29 51.44,34.29 | 51.44,34.29 R28.1
N$66
  Top 0.254: R1.S 9.53,81.28 1.91,73.66 1.91,71.75 4.45,69.22 4.45,60.96 3.18,59.69 3.18,43.82 6.35,40.64 6.35,38.73 10.16,34.92 10.16,32.38 12.7,29.84 12.7,27.94 13.97,26.67 19.68,26.67 C26.+
N$67
  Top 0.254: R6.2 14.61,67.31 20.96,67.31 C4.+
N$68
  Top 0.254: Q3.3 48.26,66.04 R13.2
N$70
  Top 0.254: IC2.6 18.41,55.88 R7.2 | C5.1 19.68,59.69 17.14,59.69 R7.2 | R5.1 R6.1 R7.2
N$71
  Top 0.254: C39.1 28.57,22.86 | 28.57,22.86 R46.2 | 28.57,22.86 R43.2
N$72
  Top 0.254: R23.1 C26.-
N$74
  Top 0.254: R50.1 13.34,17.78 15.88,20.32 R49.2 C38.1
N$75
  Top 0.254: R56.2 R54.1 36.2,10.16 IC7.3
N$76
  Top 0.254: R54.2 R53.2 27.3,6.35 C45.2
N$77
  Top 0.254: 46.35,20.95 41.91,20.95 41.27,20.32 IC7.12 IC7.5 R55.1 | 46.35,20.95 IC7.10 | R45.1 46.35,22.86 46.35,20.95
N$78
  Top 0.254: R50.2 Q5.3
N$80
  Top 0.254: R51.1 13.34,12.7 15.88,10.16 R52.2 C42.1
N$81
  Top 0.254: R51.2 Q6.3
VCA_OUT  (via drill 0.6)
  Top 0.254: R12.1 40.01,57.15 42.55,57.15 43.81,55.88 IC3.9 43.81,53.34 43.18,52.71 23.5,52.71 22.86,53.34 22.86,56.52 C4.- | v41.27,29.84 41.27,43.82 v42.55,45.09
  Bottom 0.254: R45.2 v41.27,29.84 | v42.55,45.09 42.55,52.07 43.81,53.34 IC3.9
VCC  (via drill 0.6)
  Top 0.61: 13.34,49.53 IC2.8 C13.1 | 13.34,49.53 20.32,49.53 22.23,51.44 v37.47,51.44 v55.24,51.44 81.92,51.44 | J5.2 10.79,46.99 13.34,49.53 | IC4.4 C19.1 | C11.1 81.92,55.88 IC5.11 81.92,51.44 | 61.59,15.88 v73.03,15.88 93.3,15.88 97.16,19.72 v97.16,22.22 97.16,44.45 v93.34,48.26 | 61.59,15.88 59.05,15.88 | 59.05,15.88 51.44,15.88 | 51.44,15.88 45.72,15.88 43.81,17.78 IC7.11 | 59.05,15.88 IC8.12 | 61.59,15.88 IC8.11 | IC9.1 75.56,8.89 C48.+ C47.1 66.67,7.62 67.95,8.89 71.75,8.89 73.03,10.16 v73.03,12.07 | IC10.OUT C41.+ 103.5,16.51 106.05,19.05 C40.1 106.05,21.59 105.41,22.22 v99.69,22.22 | 81.92,51.44 v93.34,51.44 | 51.44,15.88 C33.1 53.98,20.32 IC8.14
  Bottom 0.406: C6.1 38.73,55.88 IC3.11
  Bottom 0.61: IC4.4 56.52,48.9 55.24,50.16 v55.24,51.44 | v37.47,51.44 38.73,52.71 IC3.11 | v73.03,15.88 v73.03,12.07 | v93.34,51.44 v93.34,48.26 | v97.16,22.22 v99.69,22.22
VCO_POT
  Top 0.254: IC9.6 88.27,12.7 87.63,13.34 69.22,13.34 | 69.22,13.34 67.31,13.34 66.67,12.7 IC8.6 66.67,10.16 62.87,6.35 JP1.2 | 69.22,13.34 IC8.7
VEE  (via drill 0.6)
  Top 0.254: C8.2 57.78,59.69 57.78,62.23 56.52,63.5 R15.1 56.52,67.31 | R30.1 57.78,36.83 v57.78,50.16 | R12.2 46.99,66.04 48.26,67.31 56.52,67.31 | 56.52,67.31 R4.1
  Top 0.406: R20.2 88.9,64.14 v88.9,52.71 | R47.2 40.01,21.59 40.01,6.98 41.91,5.08 C46.2
  Top 0.61: 81.92,50.16 v57.78,50.16 v40.01,50.16 22.86,50.16 20.96,48.26 IC2.4 C17.2 | 81.92,50.16 v88.9,50.16 93.34,50.16 98.42,45.09 98.42,23.49 | 81.92,50.16 IC5.6 81.92,45.72 C22.2 | IC4.11 56.52,55.88 C8.2 | IC3.6 C18.2 | IC6.OUT C24.- 103.5,29.21 106.05,26.67 C32.2 106.05,24.13 105.41,23.49 98.42,23.49 | 98.42,23.49 98.42,19.05 93.98,14.61 53.34,14.61 51.44,12.7 51.44,10.48 50.16,9.21 46.67,9.21 43.81,6.35 | 43.81,6.35 IC7.6 | C46.2 43.81,6.35
  Bottom 0.406: R36.2 87,40.64 C22.2 | v88.9,50.16 v88.9,52.71
  Bottom 0.61: IC4.11 56.52,52.71 57.78,51.44 v57.78,50.16 | v40.01,50.16 38.73,48.9 IC3.6

### Text on the board
tPlace: V/Oct | CV1> | CV2> | Q> | F> | VCA> | OSC> | GND | +5V | P_EN> | EN> | CLK> | SER> | GND | +5V
tNames: IN | OUT | NP | Mutable instruments | LP2+Delay v0.1 | NP | NP | NP | LVL | TIME